# EAGLE design WheeStat5_1d (EAGLE 6.4)
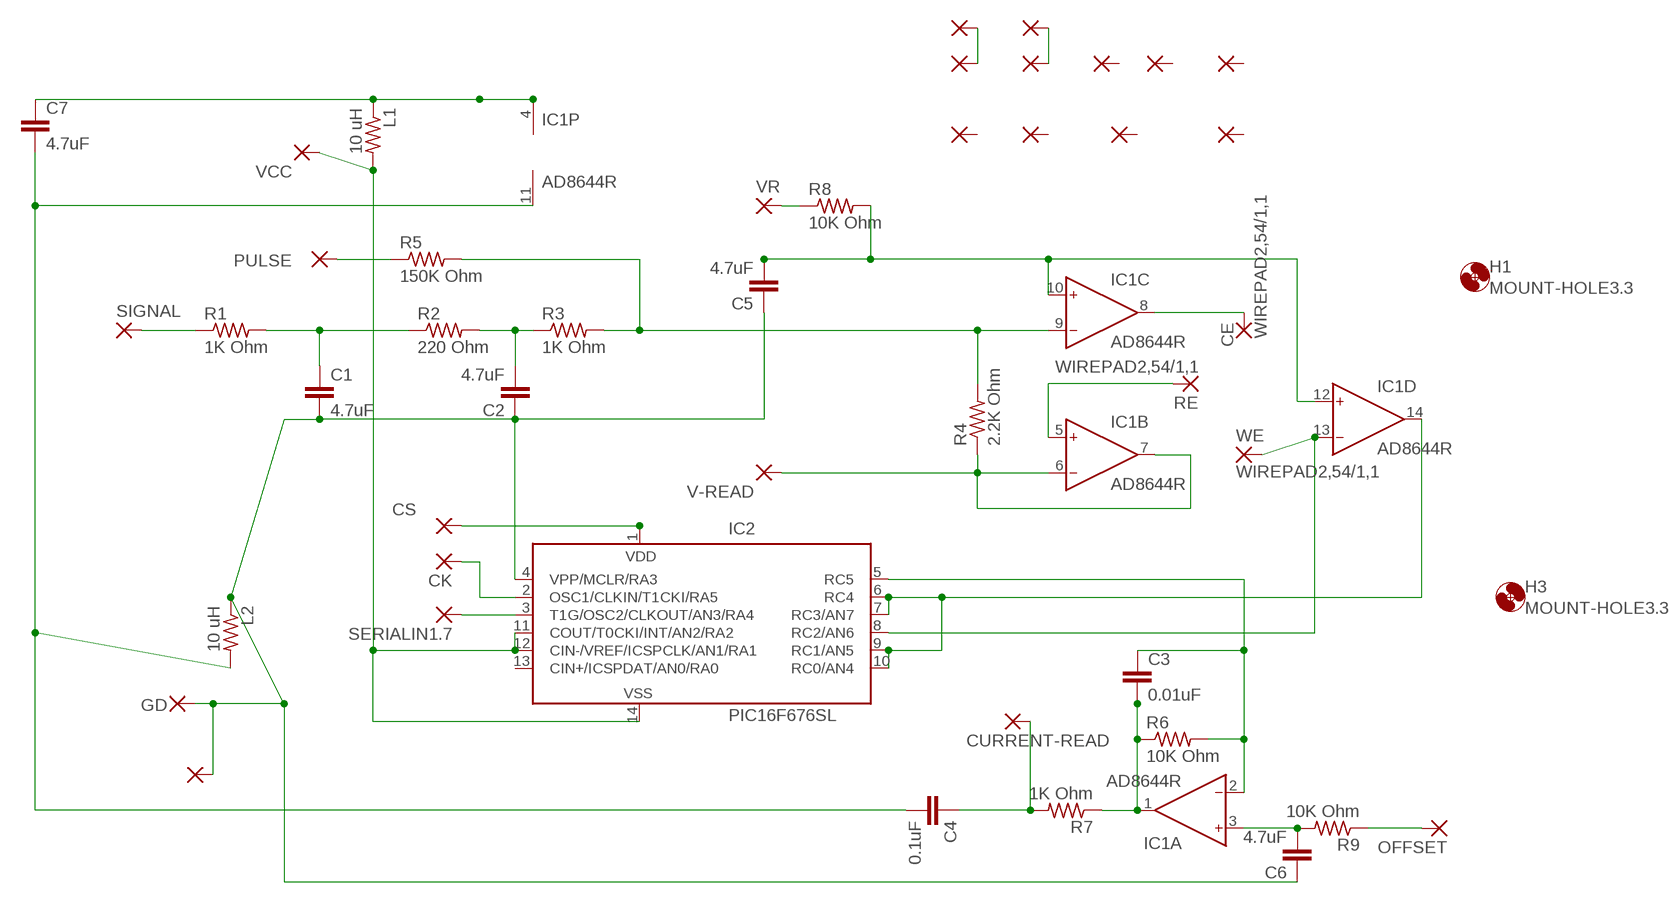
[diagram p0: schematic, sheet 1]

## Parts
1  1,6/0,9  [1,6/0,9]
1.1  1,6/0,9  [1,6/0,9]
1.2  1,6/0,9  [1,6/0,9]
1.3  1,6/0,9  [1,6/0,9]
1.4  1,6/0,9  [1,6/0,9]
2  1,6/0,9  [1,6/0,9]
3  1,6/0,9  [1,6/0,9]
4  1,6/0,9  [1,6/0,9]
5  1,6/0,9  [1,6/0,9]
6  1,6/0,9  [1,6/0,9]
7  1,6/0,9  [1,6/0,9]
8  1,6/0,9  [1,6/0,9]
C1  4.7uF  C-EUC1206K  [C1206K]
C2  4.7uF  C-EUC1206K  [C1206K]
C3  0.01uF  C-EUC0805  [C0805]
C4  0.1uF  C-EUC1206K  [C1206K]
C5  4.7uF  C-EUC1206K  [C1206K]
C6  4.7uF  C-EUC1206K  [C1206K]
C7  4.7uF  C-EUC1206K  [C1206K]
CE  WIREPAD2,54/1,1  [2,54/1,1]
CK  1,6/0,9  [1,6/0,9]
CS  1,6/0,9  [1,6/0,9]
CURRENT-READ  1,6/0,9  [1,6/0,9]
GD  1,6/0,9  [1,6/0,9]
H1  MOUNT-HOLE3.3  [3,3]
H3  MOUNT-HOLE3.3  [3,3]
IC1  AD8644R  [SO14]
IC2  PIC16F676SL  [SO-14]
L1  10 uH  R-US_R0805  [R0805]
L2  10 uH  R-US_R0805  [R0805]
OFFSET  1,6/0,9  [1,6/0,9]
PULSE  1,6/0,9  [1,6/0,9]
R1  1K Ohm  R-US_R0805  [R0805]
R2  220 Ohm  R-US_R0805  [R0805]
R3  1K Ohm  R-US_R0805  [R0805]
R4  2.2K Ohm  R-US_R0805  [R0805]
R5  150K Ohm  R-US_R0805  [R0805]
R6  10K Ohm  R-US_R0805  [R0805]
R7  1K Ohm  R-US_R0805  [R0805]
R8  10K Ohm  R-US_R0805  [R0805]
R9  10K Ohm  R-US_R0805  [R0805]
RE  WIREPAD2,54/1,1  [2,54/1,1]
SERIALIN1.7  1,6/0,9  [1,6/0,9]
SIGNAL  1,6/0,9  [1,6/0,9]
V-READ  1,6/0,9  [1,6/0,9]
VCC  1,6/0,9  [1,6/0,9]
VR  1,6/0,9  [1,6/0,9]
WE  WIREPAD2,54/1,1  [2,54/1,1]

## Nets
N$1: C5.2 IC1.10(C:IN+) IC1.12(D:IN+) R8.2
N$2: IC1.6(B:IN-) IC1.7(B:OUT) R4.1 V-READ.1(P)
N$3: IC1.5(B:IN+) RE.1(P)
N$4: C4.1 CURRENT-READ.1(P) R7.2
N$5: CE.1(P) IC1.8(C:OUT)
N$6: 1.2.1(P) 1.3.1(P)
N$7: 1.4.1(P) 8.1(P)
N$9: R1.1 SIGNAL.1(P)
N$10: C3.2 IC1.1(A:OUT) R6.1 R7.1
N$11: C4.2 C7.2 IC1.11(P:V-) L2.2
N$12: PULSE.1(P) R5.1
N$13: C1.1 R1.2 R2.1
N$14: 1.1.1(P) C1.2 C2.1 C5.1 C6.1 GD.1(P) IC2.4(VPP/MCLR/RA3) L2.1
N$15: CS.1(P) IC2.1(VDD)
N$17: IC1.13(D:IN-) IC2.8(RC2/AN6) WE.1(P)
N$18: IC2.11(COUT/T0CKI/INT/AN2/RA2) IC2.12(CIN-/VREF/ICSPCLK/AN1/RA1) IC2.14(VSS) L1.2 VCC.1(P)
N$19: C2.2 R2.2 R3.1
N$20: IC2.3(T1G/OSC2/CLKOUT/AN3/RA4) SERIALIN1.7.1(P)
N$21: IC1.9(C:IN-) R3.2 R4.2 R5.2
N$23: IC1.14(D:OUT) IC2.6(RC4) IC2.7(RC3/AN7) IC2.9(RC1/AN5) IC2.10(RC0/AN4)
N$24: CK.1(P) IC2.2(OSC1/CLKIN/T1CKI/RA5)
N$26: C7.1 IC1.4(P:V+) L1.1
N$32: C6.2 IC1.3(A:IN+) R9.2
N$33: OFFSET.1(P) R9.1
N$34: C3.1 IC1.2(A:IN-) IC2.5(RC5) R6.2
N$37: R8.1 VR.1(P)
Unconnected: 1.1(P) 2.1(P) 3.1(P) 4.1(P) 5.1(P) 6.1(P) 7.1(P) IC2.13(CIN+/ICSPDAT/AN0/RA0)

## Library data of the parts
1 1.1-1.4 2-8 CK CS CURRENT-READ GD OFFSET PULSE SERIALIN1.7 SIGNAL V-READ VCC VR = wirepad:1,6/0,9: THROUGH-HOLE PAD
C1 C2 C4-C7 = resistor:C-EU: CAPACITOR, European symbol
C3 = rcl:C-EU: CAPACITOR, European symbol
CE RE WE = wirepad:WIREPAD: Wire PAD connect wire on PCB
H1 H3 = holes:MOUNT-HOLE: MOUNTING HOLE with drill center marker
IC1 = analog-devices:AD8644: Single and Quad 18 V Operational Amplifiers Source: http://www.analog.com/static/imported-files/data_sheets/AD8614_8644.pdf; MF: ALTERA CORPORATION; MPN: AD8644ARZ; OC_FARNELL: 1438873; OC_NEWARK: 59K7037
IC2 = microchip:PIC16F676: 14-Pin, Flash-Based 8-Bit CMOS Microcontroller High Performance RISC CPU: * Only 35 instructions to learn - All single-cycle instructions except branches * Operating speed: - DC - 20 MHz oscillator/clock input - DC - 200 ns instruction cycle * Internal and external oscillator options - Precision Internal 4 MHz oscillator factory calibrated to ±1% - External Oscillator support for crystals and resonators - 5?s wake-up from SLEEP, 3.0V, typical * Power saving SLEEP mode * Wide operating voltage range - 2.0V to 5.5V * Industrial and Extended temperature range * Low power Power-on Reset (POR) * Power-up Timer (PWRT) and Oscillator Start-up Timer (OST) * Brown-out Detect (BOD) * Watchdog Timer (WDT) with independent oscillator for reliable operation * Multiplexed MCLR/Input-pin * Interrupt-on-pin change * Individual programmable weak pull-ups * Programmable code protection * High Endurance FLASH/EEPROM Cell - 100,000 write FLASH endurance - 1,000,000 write EEPROM endurance - FLASH/Data EEPROM Retention: > 40 years * Standby Current: - 1 nA @ 2.0V, typical * Operating Current: - 8.5?A @ 32 kHz, 2.0V, typical - 100?A @ 1 MHz, 2.0V, typical * Watchdog Timer Current - 300 nA @ 2.0V, typical * Timer1 oscillator current: - 4?A @ 32 kHz, 2.0V, typical * 12 I/O pins with individual direction control * High current sink/source for direct LED drive * Analog-to-Digital Converter module (PIC16F676): - 10-bit resolution - Programmable 8-channel input - Voltage reference input * In-Circuit Serial ProgrammingTM (ICSPTM) via two pins Source: http://ww1.microchip.com/downloads/en/DeviceDoc/40039E.pdf; MF: MICROCHIP; MPN: PIC16F676-I/SL; OC_FARNELL: 9760520; OC_NEWARK: 92C4557
L1 L2 R1-R9 = rcl:R-US_: RESISTOR, American symbol

## Board
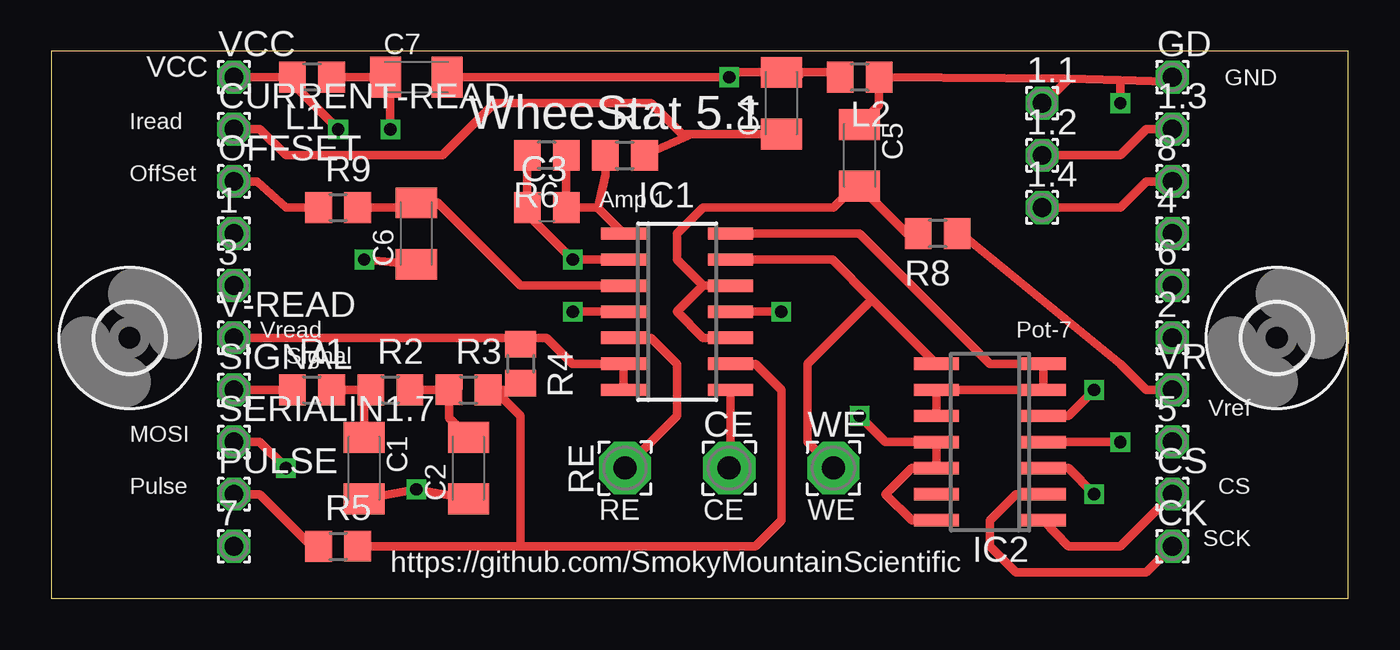
[diagram p1: board, top side]
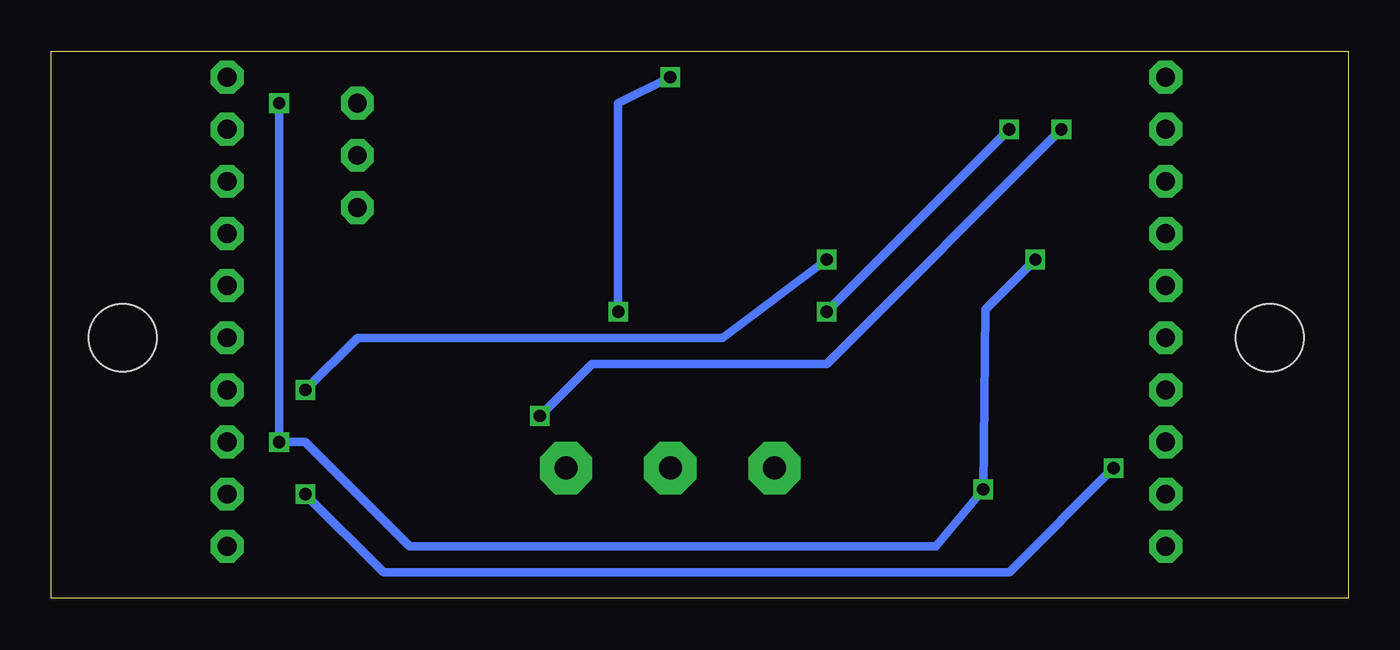
[diagram p2: board, bottom side, seen from below]

Size 63.17 x 26.66 mm. Coordinates in mm from the lower left corner, seen from the top.
Outline: 0,0 63.17,0 63.17,26.66 0,26.66 0,0
Copper layers (1*16): Top 0.035mm / dielectric 1.5mm / Bottom 0.035mm
Design rules "default *": minimum track width 6mil, minimum drill 13mil, track to track 6mil, track to pad 6mil, pad to pad 6mil, via to via 8mil, smd to smd 6mil, copper to edge 15mil, drill to drill 6mil, minimum pad ring 7mil, minimum via ring 7mil, stop-mask expansion 4mil, vias tented up to drill 0mil, thermal gap 10mil

### Footprints (pad centres in the part's own frame; a part is rotated, then mirrored left to right if it is on the bottom)
1,6/0,9 = drill 0.914 pad 1.6 octagon: 1 0,0
C1206K = smd 1.5 x 2: 1 -1.5,0; 2 1.5,0
C0805 = smd 1.3 x 1.5: 1 -0.95,0; 2 0.95,0
2,54/1,1 = drill 1.118 pad 2.54 octagon: 1 0,0
3,3 = hole 3.3: 0,0
SO14 = smd 0.6 x 2.2: 1 -3.81,-2.6; 2 -2.54,-2.6; 3 -1.27,-2.6; 4 0,-2.6; 5 1.27,-2.6; 6 2.54,-2.6; 7 3.81,-2.6; 8 3.81,2.6; 9 2.54,2.6; 10 1.27,2.6; 11 0,2.6; 12 -1.27,2.6; 13 -2.54,2.6; 14 -3.81,2.6
SO-14 = smd 0.6 x 2.2: 1 -3.81,-2.6; 2 -2.54,-2.6; 3 -1.27,-2.6; 4 0,-2.6; 5 1.27,-2.6; 6 2.54,-2.6; 7 3.81,-2.6; 8 3.81,2.6; 9 2.54,2.6; 10 1.27,2.6; 11 0,2.6; 12 -1.27,2.6; 13 -2.54,2.6; 14 -3.81,2.6
R0805 = smd 1.3 x 1.5: 1 -0.95,0; 2 0.95,0

### Placement (x,y rotation side)
1  8.89,17.78 0 top
1.1  48.26,24.13 0 top
1.2  48.26,21.59 0 top
1.3  54.61,22.86 0 top
1.4  48.26,19.05 0 top
2  54.61,12.7 0 top
3  8.89,15.24 0 top
4  54.61,17.78 0 top
5  54.61,7.62 0 top
6  54.61,15.24 0 top
7  8.89,2.54 0 top
8  54.61,20.32 0 top
C1  15.24,6.35 270 top
C2  20.32,6.35 90 top
C3  24.13,19.05 0 top
C4  35.56,24.13 90 top
C5  39.37,21.59 270 top
C6  17.78,17.78 90 top
C7  17.78,25.4 0 top
CE  33.02,6.35 0 top
CK  54.61,2.54 0 top
CS  54.61,5.08 0 top
CURRENT-READ  8.89,22.86 0 top
GD  54.61,25.4 0 top
H1  3.81,12.7 0 top
H3  59.69,12.7 0 top
IC1  30.48,13.97 270 top
IC2  45.72,7.62 90 top
L1  12.7,25.4 180 top
L2  39.37,25.4 180 top
OFFSET  8.89,20.32 0 top
PULSE  8.89,5.08 0 top
R1  12.7,10.16 0 top
R2  16.51,10.16 0 top
R3  20.32,10.16 359.8 top
R4  22.86,11.43 270 top
R5  13.97,2.54 0.2 top
R6  24.13,21.59 180 top
R7  27.94,21.59 0 top
R8  43.18,17.78 180 top
R9  13.97,19.05 0 top
RE  27.94,6.35 90 top
SERIALIN1.7  8.89,7.62 0 top
SIGNAL  8.89,10.16 0 top
V-READ  8.89,12.7 0 top
VCC  8.89,25.4 0 top
VR  54.61,10.16 0 top
WE  38.1,6.35 0 top

### Tracks (layer width: path | path; a pad name or v marks a point on that pad's centre or on a via)
N$1
  Top 0.406: IC1.10 31.75,12.7 30.48,13.97 31.75,15.24 | IC1.12 31.75,15.24 | 31.75,15.24 30.48,16.51 30.48,17.78 31.75,19.05 38.1,19.05 39.14,20.09 C5.2 41.68,17.78 R8.2
N$2
  Top 0.406: IC1.7 IC1.6 25.4,11.43 24.13,12.7 23.18,12.7 R4.1 22.54,12.7 V-READ.1
N$3
  Top 0.406: IC1.5 29.21,12.7 30.48,11.43 30.48,8.89 RE.1
N$4
  Top 0.406: CURRENT-READ.1 10.16,22.86 11.43,21.59 19.05,21.59 21.59,24.13 29.21,24.13 30.71,22.63 31.2,22.63 | C4.1 31.2,22.63 | 31.2,22.63 R7.2
N$5
  Top 0.406: IC1.8 33.08,6.41 CE.1
N$6
  Top 0.406: 1.2.1 52.07,21.59 53.34,22.86 1.3.1
N$7
  Top 0.406: 1.4.1 52.07,19.05 53.34,20.32 8.1
N$9
  Top 0.406: SIGNAL.1 R1.1
N$10
  Top 0.406: 27.94,17.78 IC1.1 26.64,19.02 | R6.1 C3.2 26.61,19.05 26.64,19.02 | R7.1 26.99,20.64 26.64,19.02
N$11  (via drill 0.6)
  Top 0.406: IC1.11 v35.56,13.97 | C7.2 v33.02,25.4 33.25,25.63 C4.2 35.56,25.4 36.37,25.4 36.6,25.63 38.19,25.63 L2.2
  Bottom 0.406: v35.56,13.97 35.56,24.13 v33.02,25.4
N$12
  Top 0.406: R5.1 12.57,2.67 | 12.7,2.54 12.57,2.67 | 12.57,2.67 10.16,5.08 PULSE.1
N$13
  Top 0.406: R1.2 15.24,10.16 | 15.24,10.16 R2.1 | C1.1 15.24,10.16
N$14  (via drill 0.6)
  Top 0.406: 49.57,25.33 L2.1 40.32,24.04 C5.1 | 49.57,25.33 52.07,25.26 | 52.07,25.26 54.38,25.17 GD.1 | C1.2 v17.78,5.31 C2.1 | IC2.4 v52.07,7.62 | C6.1 v15.24,16.51 | 52.07,25.26 v52.07,24.14 v52.07,24.13 | 1.1.1 48.36,24.13 49.57,25.33
  Bottom 0.406: v52.07,24.13 v52.07,7.62 50.8,7.62 45.72,2.54 20.09,2.54 v17.78,5.31 17.66,14.08 v15.24,16.51
N$15
  Top 0.406: IC2.1 49.53,2.54 52.07,2.54 CS.1
N$17
  Top 0.406: IC1.13 38.04,16.51 39.98,14.58 | 39.98,14.58 IC2.8 | WE.1 36.83,7.62 36.83,11.43 39.98,14.58
N$18  (via drill 0.6)
  Top 0.406: VCC.1 L1.2 11.43,25.4 v13.97,22.86 | IC2.14 41.91,3.81 40.64,5.08 41.91,6.35 IC2.12 IC2.11 40.64,7.62 v39.37,8.89
  Bottom 0.406: v13.97,22.86 25.4,11.43 36.83,11.43 v39.37,8.89
N$19
  Top 0.406: R2.2 R3.1 19.37,8.8 C2.2
N$20  (via drill 0.6)
  Top 0.406: IC2.3 49.53,6.35 v50.8,5.08 | v11.43,6.35 10.16,7.62 SERIALIN1.7.1
  Bottom 0.406: v11.43,6.35 16.51,1.27 46.99,1.27 v50.8,5.08
N$21
  Top 0.406: R4.2 22.54,10.16 R3.2 21.59,10.16 22.86,8.89 22.86,2.54 | R5.2 22.86,2.54 | 22.86,2.54 34.29,2.54 35.56,3.81 35.56,10.16 34.29,11.43 IC1.9
N$23
  Top 0.406: IC2.10 IC2.9 IC2.6 IC2.7 48.26,11.49 48.26,11.43 45.72,11.43 39.37,17.78 IC1.14
N$24
  Top 0.406: IC2.2 46.99,5.08 45.72,3.81 45.72,2.54 46.99,1.27 53.34,1.27 CK.1
N$26  (via drill 0.6)
  Top 0.406: L1.1 C7.1 16.51,25.17 v16.51,22.86 | IC1.4 v25.4,13.97
  Bottom 0.406: v25.4,13.97 v16.51,22.86
N$32
  Top 0.406: IC1.3 22.86,15.24 18.82,19.28 C6.2 17.55,19.05 R9.2
N$33
  Top 0.406: OFFSET.1 10.03,20.32 11.43,19.05 R9.1
N$34  (via drill 0.6)
  Top 0.406: v50.8,10.16 49.53,8.89 IC2.5 | IC1.2 v25.4,16.51 23.18,18.73 C3.1 R6.2
  Bottom 0.406: v50.8,10.16 48.26,12.7 30.48,12.7 v25.4,16.51
N$37
  Top 0.406: VR.1 53.34,10.16 52.07,11.43 44.45,17.65 R8.1

### Text on the board
tPlace: VCC | GND | Iread | WheeStat 5.1 | OffSet | Amp 1 | Vread | Pot-7 | Signal | Vref | MOSI | Pulse | CS | RE | CE | WE | SCK | https://github.com/SmokyMountainScientific